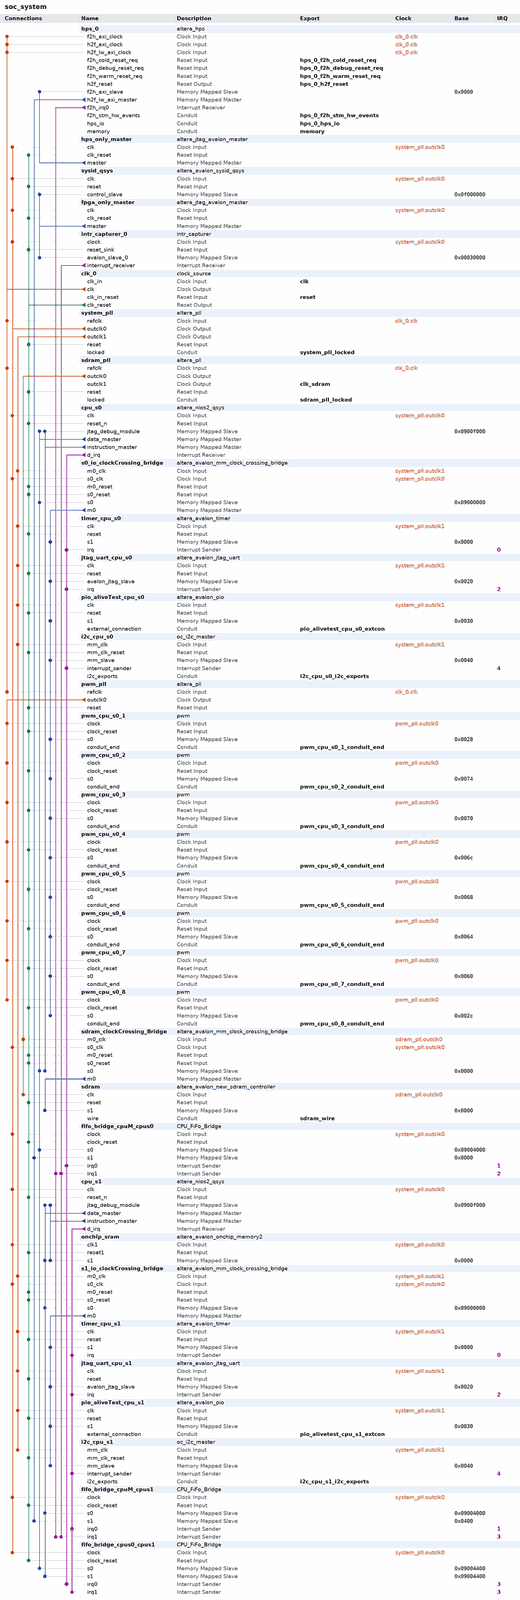
[diagram p0: system contents, whole]
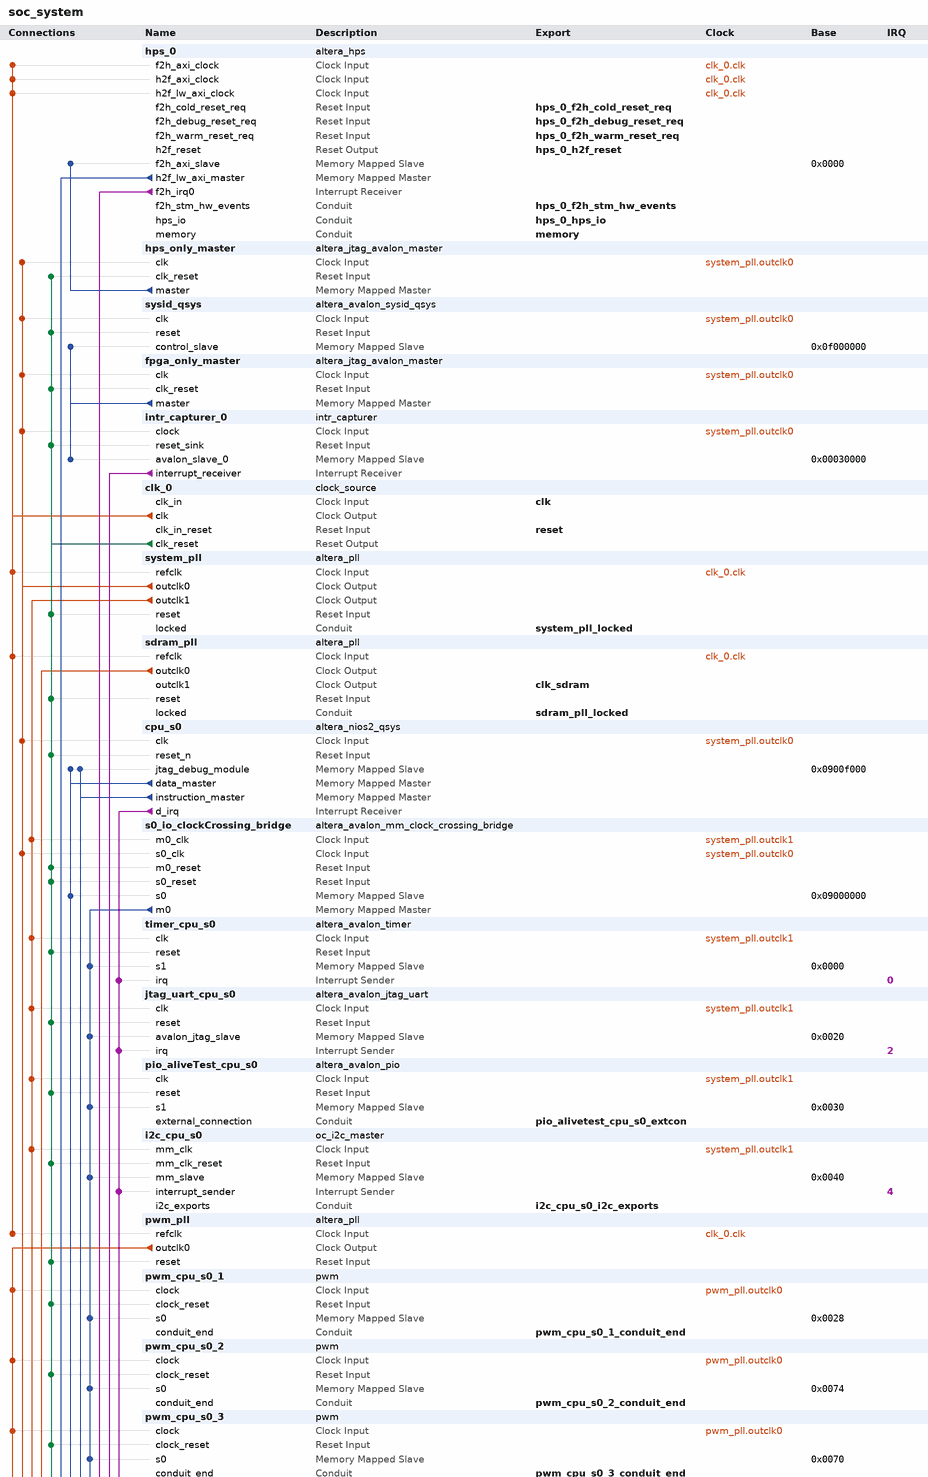
[diagram p1: system contents, upper part]
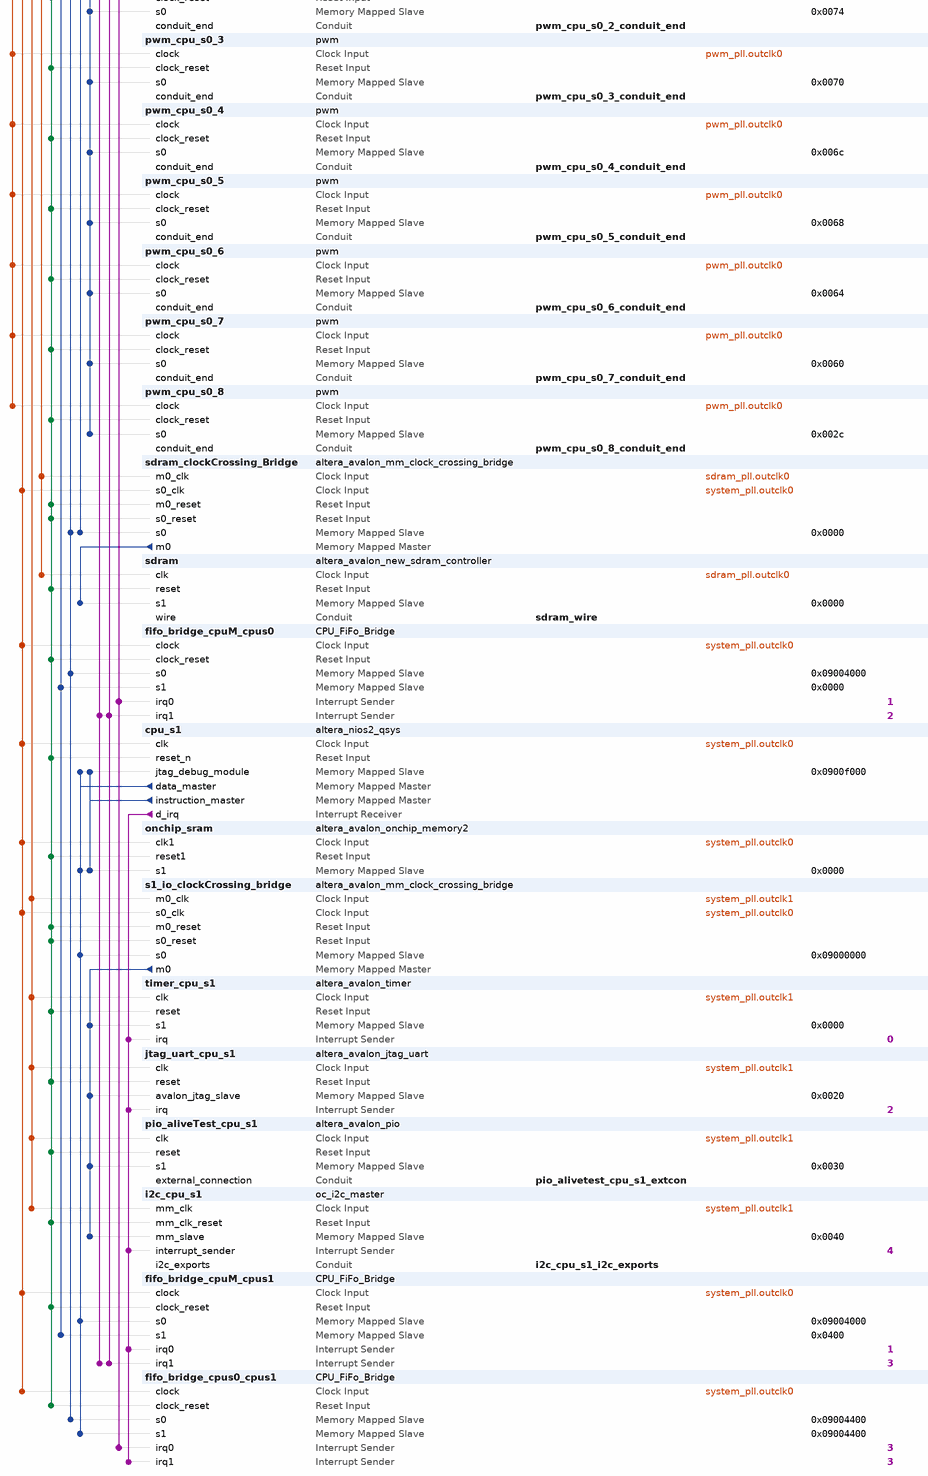
[diagram p2: system contents, lower part]
# Platform Designer (Qsys) system soc_system, Cyclone V 5CSEMA5F31C6
# Parameters at their usual value, and those the tool derives, are not listed.
package require -exact qsys 13.1
create_system soc_system
set_project_property DEVICE_FAMILY {Cyclone V}
set_project_property DEVICE 5CSEMA5F31C6

add_instance hps_0 altera_hps 13.1
set_instance_parameter_value hps_0 MEM_VENDOR JEDEC
set_instance_parameter_value hps_0 MEM_ROW_ADDR_WIDTH 15
set_instance_parameter_value hps_0 MEM_COL_ADDR_WIDTH 10
set_instance_parameter_value hps_0 MEM_DQ_WIDTH 32
set_instance_parameter_value hps_0 MEM_BANKADDR_WIDTH 3
set_instance_parameter_value hps_0 MEM_DRV_STR RZQ/7
set_instance_parameter_value hps_0 MEM_RTT_NOM RZQ/4
set_instance_parameter_value hps_0 MEM_RTT_WR RZQ/4
set_instance_parameter_value hps_0 MEM_WTCL 8
set_instance_parameter_value hps_0 MEM_TCL 11
set_instance_parameter_value hps_0 TIMING_TIS 180
set_instance_parameter_value hps_0 TIMING_TIH 140
set_instance_parameter_value hps_0 TIMING_TDS 30
set_instance_parameter_value hps_0 TIMING_TDH 65
set_instance_parameter_value hps_0 TIMING_TDQSQ 125
set_instance_parameter_value hps_0 TIMING_TDQSCK 255
set_instance_parameter_value hps_0 TIMING_TQSH 0.4
set_instance_parameter_value hps_0 MEM_TRAS_NS 35.0
set_instance_parameter_value hps_0 MEM_TRCD_NS 13.75
set_instance_parameter_value hps_0 MEM_TRP_NS 13.75
set_instance_parameter_value hps_0 MEM_TRFC_NS 260.0
set_instance_parameter_value hps_0 MEM_TFAW_NS 30.0
set_instance_parameter_value hps_0 REF_CLK_FREQ 25.0
set_instance_parameter_value hps_0 DEFAULT_FAST_SIM_MODEL true
set_instance_parameter_value hps_0 TIMING_BOARD_MAX_CK_DELAY 0.03
set_instance_parameter_value hps_0 TIMING_BOARD_MAX_DQS_DELAY 0.02
set_instance_parameter_value hps_0 TIMING_BOARD_SKEW_CKDQS_DIMM_MIN 0.09
set_instance_parameter_value hps_0 TIMING_BOARD_SKEW_CKDQS_DIMM_MAX 0.16
set_instance_parameter_value hps_0 TIMING_BOARD_SKEW_WITHIN_DQS 0.01
set_instance_parameter_value hps_0 TIMING_BOARD_SKEW_BETWEEN_DQS 0.08
set_instance_parameter_value hps_0 TIMING_BOARD_DQ_TO_DQS_SKEW 0.0
set_instance_parameter_value hps_0 TIMING_BOARD_AC_SKEW 0.03
set_instance_parameter_value hps_0 TIMING_BOARD_AC_TO_CK_SKEW 0.0
set_instance_parameter_value hps_0 MEM_CLK_FREQ 400.0
set_instance_parameter_value hps_0 HPS_PROTOCOL DDR3
set_instance_parameter_value hps_0 STM_Enable true
set_instance_parameter_value hps_0 F2S_Width 2
set_instance_parameter_value hps_0 S2F_Width 2
set_instance_parameter_value hps_0 LWH2F_Enable true
set_instance_parameter_value hps_0 F2SCLK_DBGRST_Enable true
set_instance_parameter_value hps_0 F2SCLK_WARMRST_Enable true
set_instance_parameter_value hps_0 F2SCLK_COLDRST_Enable true
set_instance_parameter_value hps_0 F2SINTERRUPT_Enable true
set_instance_parameter_value hps_0 EMAC1_PinMuxing {HPS I/O Set 0}
set_instance_parameter_value hps_0 EMAC1_Mode RGMII
set_instance_parameter_value hps_0 QSPI_PinMuxing {HPS I/O Set 0}
set_instance_parameter_value hps_0 QSPI_Mode {1 SS}
set_instance_parameter_value hps_0 SDIO_PinMuxing {HPS I/O Set 0}
set_instance_parameter_value hps_0 SDIO_Mode {4-bit Data}
set_instance_parameter_value hps_0 USB1_PinMuxing {HPS I/O Set 0}
set_instance_parameter_value hps_0 USB1_Mode SDR
set_instance_parameter_value hps_0 SPIM1_PinMuxing {HPS I/O Set 0}
set_instance_parameter_value hps_0 SPIM1_Mode {Single Slave Select}
set_instance_parameter_value hps_0 UART0_PinMuxing {HPS I/O Set 0}
set_instance_parameter_value hps_0 UART0_Mode {No Flow Control}
set_instance_parameter_value hps_0 I2C0_PinMuxing {HPS I/O Set 0}
set_instance_parameter_value hps_0 I2C0_Mode I2C
set_instance_parameter_value hps_0 I2C1_PinMuxing {HPS I/O Set 0}
set_instance_parameter_value hps_0 I2C1_Mode I2C
set_instance_parameter_value hps_0 S2FCLK_USER1CLK_FREQ 100
set_instance_parameter_value hps_0 FPGA_PERIPHERAL_OUTPUT_CLOCK_FREQ_EMAC0_MD_CLK 100
set_instance_parameter_value hps_0 FPGA_PERIPHERAL_OUTPUT_CLOCK_FREQ_EMAC0_GTX_CLK 100
set_instance_parameter_value hps_0 FPGA_PERIPHERAL_OUTPUT_CLOCK_FREQ_EMAC1_MD_CLK 100
set_instance_parameter_value hps_0 FPGA_PERIPHERAL_OUTPUT_CLOCK_FREQ_EMAC1_GTX_CLK 100

add_instance hps_only_master altera_jtag_avalon_master 13.1

add_instance sysid_qsys altera_avalon_sysid_qsys 13.1
set_instance_parameter_value sysid_qsys id -1395322110

add_instance fpga_only_master altera_jtag_avalon_master 13.1

add_instance intr_capturer_0 intr_capturer 100.99.98.97

add_instance clk_0 clock_source 13.1
set_instance_parameter_value clk_0 clockFrequency 50000000

add_instance system_pll altera_pll 13.1
set_instance_parameter_value system_pll gui_device_speed_grade 2
set_instance_parameter_value system_pll gui_pll_mode {Integer-N PLL}
set_instance_parameter_value system_pll gui_reference_clock_frequency 50.0
set_instance_parameter_value system_pll gui_operation_mode direct
set_instance_parameter_value system_pll gui_use_locked true
set_instance_parameter_value system_pll gui_number_of_clocks 2
set_instance_parameter_value system_pll gui_output_clock_frequency0 125.0
set_instance_parameter_value system_pll gui_output_clock_frequency1 25.0

add_instance sdram_pll altera_pll 13.1
set_instance_parameter_value sdram_pll gui_device_speed_grade 2
set_instance_parameter_value sdram_pll gui_pll_mode {Integer-N PLL}
set_instance_parameter_value sdram_pll gui_reference_clock_frequency 100.0
set_instance_parameter_value sdram_pll gui_operation_mode direct
set_instance_parameter_value sdram_pll gui_use_locked true
set_instance_parameter_value sdram_pll gui_number_of_clocks 2
set_instance_parameter_value sdram_pll gui_output_clock_frequency0 143.0
set_instance_parameter_value sdram_pll gui_output_clock_frequency1 143.0
set_instance_parameter_value sdram_pll gui_phase_shift1 -3758

add_instance cpu_s0 altera_nios2_qsys 13.1
set_instance_parameter_value cpu_s0 resetSlave sdram.s1
set_instance_parameter_value cpu_s0 mmu_TLBMissExcSlave None
set_instance_parameter_value cpu_s0 exceptionSlave sdram.s1
set_instance_parameter_value cpu_s0 breakSlave cpu_s0.jtag_debug_module
set_instance_parameter_value cpu_s0 impl Fast
set_instance_parameter_value cpu_s0 icache_size 4096
set_instance_parameter_value cpu_s0 icache_burstType Sequential
set_instance_parameter_value cpu_s0 dcache_size 0

add_instance s0_io_clockCrossing_bridge altera_avalon_mm_clock_crossing_bridge 13.1
set_instance_parameter_value s0_io_clockCrossing_bridge DATA_WIDTH 32
set_instance_parameter_value s0_io_clockCrossing_bridge ADDRESS_WIDTH 10
set_instance_parameter_value s0_io_clockCrossing_bridge MAX_BURST_SIZE 1
set_instance_parameter_value s0_io_clockCrossing_bridge COMMAND_FIFO_DEPTH 4
set_instance_parameter_value s0_io_clockCrossing_bridge RESPONSE_FIFO_DEPTH 4
set_instance_parameter_value s0_io_clockCrossing_bridge MASTER_SYNC_DEPTH 2
set_instance_parameter_value s0_io_clockCrossing_bridge SLAVE_SYNC_DEPTH 2

add_instance timer_cpu_s0 altera_avalon_timer 13.1
set_instance_parameter_value timer_cpu_s0 period 10
set_instance_parameter_value timer_cpu_s0 periodUnits MSEC

add_instance jtag_uart_cpu_s0 altera_avalon_jtag_uart 13.1
set_instance_parameter_value jtag_uart_cpu_s0 simInteractiveOptions NO_INTERACTIVE_WINDOWS

add_instance pio_aliveTest_cpu_s0 altera_avalon_pio 13.1
set_instance_parameter_value pio_aliveTest_cpu_s0 direction Output
set_instance_parameter_value pio_aliveTest_cpu_s0 width 2

add_instance i2c_cpu_s0 oc_i2c_master 8.0
set_instance_parameter_value i2c_cpu_s0 CLK_FREQ 25000000

add_instance pwm_pll altera_pll 13.1
set_instance_parameter_value pwm_pll gui_device_speed_grade 2
set_instance_parameter_value pwm_pll gui_pll_mode {Integer-N PLL}
set_instance_parameter_value pwm_pll gui_reference_clock_frequency 50.0
set_instance_parameter_value pwm_pll gui_operation_mode direct
set_instance_parameter_value pwm_pll gui_use_locked true
set_instance_parameter_value pwm_pll gui_number_of_clocks 1
set_instance_parameter_value pwm_pll gui_output_clock_frequency0 1.505199
set_instance_parameter_value pwm_pll gui_actual_output_clock_frequency0 {1.505050 MHz}

add_instance pwm_cpu_s0_1 pwm 1.0

add_instance pwm_cpu_s0_2 pwm 1.0

add_instance pwm_cpu_s0_3 pwm 1.0

add_instance pwm_cpu_s0_4 pwm 1.0

add_instance pwm_cpu_s0_5 pwm 1.0

add_instance pwm_cpu_s0_6 pwm 1.0

add_instance pwm_cpu_s0_7 pwm 1.0

add_instance pwm_cpu_s0_8 pwm 1.0

add_instance sdram_clockCrossing_Bridge altera_avalon_mm_clock_crossing_bridge 13.1
set_instance_parameter_value sdram_clockCrossing_Bridge DATA_WIDTH 32
set_instance_parameter_value sdram_clockCrossing_Bridge ADDRESS_WIDTH 26
set_instance_parameter_value sdram_clockCrossing_Bridge MAX_BURST_SIZE 8
set_instance_parameter_value sdram_clockCrossing_Bridge COMMAND_FIFO_DEPTH 4
set_instance_parameter_value sdram_clockCrossing_Bridge RESPONSE_FIFO_DEPTH 16
set_instance_parameter_value sdram_clockCrossing_Bridge MASTER_SYNC_DEPTH 2
set_instance_parameter_value sdram_clockCrossing_Bridge SLAVE_SYNC_DEPTH 2

add_instance sdram altera_avalon_new_sdram_controller 13.1
set_instance_parameter_value sdram TAC 5.4
set_instance_parameter_value sdram TRCD 15.0
set_instance_parameter_value sdram TRP 15.0
set_instance_parameter_value sdram casLatency 3
set_instance_parameter_value sdram columnWidth 10
set_instance_parameter_value sdram dataWidth 16
set_instance_parameter_value sdram generateSimulationModel false
set_instance_parameter_value sdram model single_Micron_MT48LC4M32B2_7_chip
set_instance_parameter_value sdram numberOfBanks 4
set_instance_parameter_value sdram numberOfChipSelects 1
set_instance_parameter_value sdram powerUpDelay 100.0
set_instance_parameter_value sdram refreshPeriod 7.8125
set_instance_parameter_value sdram rowWidth 13

add_instance fifo_bridge_cpuM_cpus0 CPU_FiFo_Bridge 1.0

add_instance cpu_s1 altera_nios2_qsys 13.1
set_instance_parameter_value cpu_s1 resetSlave onchip_sram.s1
set_instance_parameter_value cpu_s1 mmu_TLBMissExcSlave None
set_instance_parameter_value cpu_s1 exceptionSlave onchip_sram.s1
set_instance_parameter_value cpu_s1 breakSlave cpu_s1.jtag_debug_module
set_instance_parameter_value cpu_s1 impl Fast
set_instance_parameter_value cpu_s1 icache_size 4096
set_instance_parameter_value cpu_s1 dcache_size 0

add_instance onchip_sram altera_avalon_onchip_memory2 13.1
set_instance_parameter_value onchip_sram dataWidth 32
set_instance_parameter_value onchip_sram dualPort false
set_instance_parameter_value onchip_sram initMemContent true
set_instance_parameter_value onchip_sram initializationFileName onchip_memory2_0
set_instance_parameter_value onchip_sram memorySize 360448

add_instance s1_io_clockCrossing_bridge altera_avalon_mm_clock_crossing_bridge 13.1
set_instance_parameter_value s1_io_clockCrossing_bridge DATA_WIDTH 32
set_instance_parameter_value s1_io_clockCrossing_bridge ADDRESS_WIDTH 10
set_instance_parameter_value s1_io_clockCrossing_bridge MAX_BURST_SIZE 1
set_instance_parameter_value s1_io_clockCrossing_bridge COMMAND_FIFO_DEPTH 4
set_instance_parameter_value s1_io_clockCrossing_bridge RESPONSE_FIFO_DEPTH 4
set_instance_parameter_value s1_io_clockCrossing_bridge MASTER_SYNC_DEPTH 2
set_instance_parameter_value s1_io_clockCrossing_bridge SLAVE_SYNC_DEPTH 2

add_instance timer_cpu_s1 altera_avalon_timer 13.1
set_instance_parameter_value timer_cpu_s1 period 10
set_instance_parameter_value timer_cpu_s1 periodUnits MSEC

add_instance jtag_uart_cpu_s1 altera_avalon_jtag_uart 13.1
set_instance_parameter_value jtag_uart_cpu_s1 simInteractiveOptions NO_INTERACTIVE_WINDOWS

add_instance pio_aliveTest_cpu_s1 altera_avalon_pio 13.1
set_instance_parameter_value pio_aliveTest_cpu_s1 direction Output
set_instance_parameter_value pio_aliveTest_cpu_s1 width 2

add_instance i2c_cpu_s1 oc_i2c_master 8.0
set_instance_parameter_value i2c_cpu_s1 CLK_FREQ 25000000

add_instance fifo_bridge_cpuM_cpus1 CPU_FiFo_Bridge 1.0

add_instance fifo_bridge_cpus0_cpus1 CPU_FiFo_Bridge 1.0

# connections
add_connection clk_0.clk hps_0.f2h_axi_clock clock
add_connection clk_0.clk hps_0.h2f_axi_clock clock
add_connection clk_0.clk hps_0.h2f_lw_axi_clock clock
add_connection clk_0.clk pwm_pll.refclk clock
add_connection clk_0.clk sdram_pll.refclk clock
add_connection clk_0.clk system_pll.refclk clock
add_connection pwm_pll.outclk0 pwm_cpu_s0_1.clock clock
add_connection pwm_pll.outclk0 pwm_cpu_s0_2.clock clock
add_connection pwm_pll.outclk0 pwm_cpu_s0_3.clock clock
add_connection pwm_pll.outclk0 pwm_cpu_s0_4.clock clock
add_connection pwm_pll.outclk0 pwm_cpu_s0_5.clock clock
add_connection pwm_pll.outclk0 pwm_cpu_s0_6.clock clock
add_connection pwm_pll.outclk0 pwm_cpu_s0_7.clock clock
add_connection pwm_pll.outclk0 pwm_cpu_s0_8.clock clock
add_connection sdram_pll.outclk0 sdram.clk clock
add_connection sdram_pll.outclk0 sdram_clockCrossing_Bridge.m0_clk clock
add_connection system_pll.outclk0 cpu_s0.clk clock
add_connection system_pll.outclk0 cpu_s1.clk clock
add_connection system_pll.outclk0 fifo_bridge_cpuM_cpus0.clock clock
add_connection system_pll.outclk0 fifo_bridge_cpuM_cpus1.clock clock
add_connection system_pll.outclk0 fifo_bridge_cpus0_cpus1.clock clock
add_connection system_pll.outclk0 fpga_only_master.clk clock
add_connection system_pll.outclk0 hps_only_master.clk clock
add_connection system_pll.outclk0 intr_capturer_0.clock clock
add_connection system_pll.outclk0 onchip_sram.clk1 clock
add_connection system_pll.outclk0 s0_io_clockCrossing_bridge.s0_clk clock
add_connection system_pll.outclk0 s1_io_clockCrossing_bridge.s0_clk clock
add_connection system_pll.outclk0 sdram_clockCrossing_Bridge.s0_clk clock
add_connection system_pll.outclk0 sysid_qsys.clk clock
add_connection system_pll.outclk1 i2c_cpu_s0.mm_clk clock
add_connection system_pll.outclk1 i2c_cpu_s1.mm_clk clock
add_connection system_pll.outclk1 jtag_uart_cpu_s0.clk clock
add_connection system_pll.outclk1 jtag_uart_cpu_s1.clk clock
add_connection system_pll.outclk1 pio_aliveTest_cpu_s0.clk clock
add_connection system_pll.outclk1 pio_aliveTest_cpu_s1.clk clock
add_connection system_pll.outclk1 s0_io_clockCrossing_bridge.m0_clk clock
add_connection system_pll.outclk1 s1_io_clockCrossing_bridge.m0_clk clock
add_connection system_pll.outclk1 timer_cpu_s0.clk clock
add_connection system_pll.outclk1 timer_cpu_s1.clk clock
add_connection clk_0.clk_reset cpu_s0.reset_n reset
add_connection clk_0.clk_reset cpu_s1.reset_n reset
add_connection clk_0.clk_reset fifo_bridge_cpuM_cpus0.clock_reset reset
add_connection clk_0.clk_reset fifo_bridge_cpuM_cpus1.clock_reset reset
add_connection clk_0.clk_reset fifo_bridge_cpus0_cpus1.clock_reset reset
add_connection clk_0.clk_reset fpga_only_master.clk_reset reset
add_connection clk_0.clk_reset hps_only_master.clk_reset reset
add_connection clk_0.clk_reset i2c_cpu_s0.mm_clk_reset reset
add_connection clk_0.clk_reset i2c_cpu_s1.mm_clk_reset reset
add_connection clk_0.clk_reset intr_capturer_0.reset_sink reset
add_connection clk_0.clk_reset jtag_uart_cpu_s0.reset reset
add_connection clk_0.clk_reset jtag_uart_cpu_s1.reset reset
add_connection clk_0.clk_reset onchip_sram.reset1 reset
add_connection clk_0.clk_reset pio_aliveTest_cpu_s0.reset reset
add_connection clk_0.clk_reset pio_aliveTest_cpu_s1.reset reset
add_connection clk_0.clk_reset pwm_cpu_s0_1.clock_reset reset
add_connection clk_0.clk_reset pwm_cpu_s0_2.clock_reset reset
add_connection clk_0.clk_reset pwm_cpu_s0_3.clock_reset reset
add_connection clk_0.clk_reset pwm_cpu_s0_4.clock_reset reset
add_connection clk_0.clk_reset pwm_cpu_s0_5.clock_reset reset
add_connection clk_0.clk_reset pwm_cpu_s0_6.clock_reset reset
add_connection clk_0.clk_reset pwm_cpu_s0_7.clock_reset reset
add_connection clk_0.clk_reset pwm_cpu_s0_8.clock_reset reset
add_connection clk_0.clk_reset pwm_pll.reset reset
add_connection clk_0.clk_reset s0_io_clockCrossing_bridge.m0_reset reset
add_connection clk_0.clk_reset s0_io_clockCrossing_bridge.s0_reset reset
add_connection clk_0.clk_reset s1_io_clockCrossing_bridge.m0_reset reset
add_connection clk_0.clk_reset s1_io_clockCrossing_bridge.s0_reset reset
add_connection clk_0.clk_reset sdram.reset reset
add_connection clk_0.clk_reset sdram_clockCrossing_Bridge.m0_reset reset
add_connection clk_0.clk_reset sdram_clockCrossing_Bridge.s0_reset reset
add_connection clk_0.clk_reset sdram_pll.reset reset
add_connection clk_0.clk_reset sysid_qsys.reset reset
add_connection clk_0.clk_reset system_pll.reset reset
add_connection clk_0.clk_reset timer_cpu_s0.reset reset
add_connection clk_0.clk_reset timer_cpu_s1.reset reset
add_connection cpu_s0.data_master cpu_s0.jtag_debug_module avalon
set_connection_parameter_value cpu_s0.data_master/cpu_s0.jtag_debug_module baseAddress 0x0900f000
add_connection cpu_s0.data_master fifo_bridge_cpuM_cpus0.s0 avalon
set_connection_parameter_value cpu_s0.data_master/fifo_bridge_cpuM_cpus0.s0 baseAddress 0x09004000
add_connection cpu_s0.data_master fifo_bridge_cpus0_cpus1.s0 avalon
set_connection_parameter_value cpu_s0.data_master/fifo_bridge_cpus0_cpus1.s0 baseAddress 0x09004400
add_connection cpu_s0.data_master s0_io_clockCrossing_bridge.s0 avalon
set_connection_parameter_value cpu_s0.data_master/s0_io_clockCrossing_bridge.s0 baseAddress 0x09000000
add_connection cpu_s0.data_master sdram_clockCrossing_Bridge.s0 avalon
set_connection_parameter_value cpu_s0.data_master/sdram_clockCrossing_Bridge.s0 baseAddress 0x0000
add_connection cpu_s0.instruction_master cpu_s0.jtag_debug_module avalon
set_connection_parameter_value cpu_s0.instruction_master/cpu_s0.jtag_debug_module baseAddress 0x0900f000
add_connection cpu_s0.instruction_master sdram_clockCrossing_Bridge.s0 avalon
set_connection_parameter_value cpu_s0.instruction_master/sdram_clockCrossing_Bridge.s0 baseAddress 0x0000
add_connection cpu_s1.data_master cpu_s1.jtag_debug_module avalon
set_connection_parameter_value cpu_s1.data_master/cpu_s1.jtag_debug_module baseAddress 0x0900f000
add_connection cpu_s1.data_master fifo_bridge_cpuM_cpus1.s0 avalon
set_connection_parameter_value cpu_s1.data_master/fifo_bridge_cpuM_cpus1.s0 baseAddress 0x09004000
add_connection cpu_s1.data_master fifo_bridge_cpus0_cpus1.s1 avalon
set_connection_parameter_value cpu_s1.data_master/fifo_bridge_cpus0_cpus1.s1 baseAddress 0x09004400
add_connection cpu_s1.data_master onchip_sram.s1 avalon
set_connection_parameter_value cpu_s1.data_master/onchip_sram.s1 baseAddress 0x0000
add_connection cpu_s1.data_master s1_io_clockCrossing_bridge.s0 avalon
set_connection_parameter_value cpu_s1.data_master/s1_io_clockCrossing_bridge.s0 baseAddress 0x09000000
add_connection cpu_s1.instruction_master cpu_s1.jtag_debug_module avalon
set_connection_parameter_value cpu_s1.instruction_master/cpu_s1.jtag_debug_module baseAddress 0x0900f000
add_connection cpu_s1.instruction_master onchip_sram.s1 avalon
set_connection_parameter_value cpu_s1.instruction_master/onchip_sram.s1 baseAddress 0x0000
add_connection fpga_only_master.master intr_capturer_0.avalon_slave_0 avalon
set_connection_parameter_value fpga_only_master.master/intr_capturer_0.avalon_slave_0 baseAddress 0x00030000
add_connection fpga_only_master.master sysid_qsys.control_slave avalon
set_connection_parameter_value fpga_only_master.master/sysid_qsys.control_slave baseAddress 0x0f000000
add_connection hps_0.h2f_lw_axi_master fifo_bridge_cpuM_cpus0.s1 avalon
set_connection_parameter_value hps_0.h2f_lw_axi_master/fifo_bridge_cpuM_cpus0.s1 baseAddress 0x0000
add_connection hps_0.h2f_lw_axi_master fifo_bridge_cpuM_cpus1.s1 avalon
set_connection_parameter_value hps_0.h2f_lw_axi_master/fifo_bridge_cpuM_cpus1.s1 baseAddress 0x0400
add_connection hps_only_master.master hps_0.f2h_axi_slave avalon
set_connection_parameter_value hps_only_master.master/hps_0.f2h_axi_slave baseAddress 0x0000
add_connection s0_io_clockCrossing_bridge.m0 i2c_cpu_s0.mm_slave avalon
set_connection_parameter_value s0_io_clockCrossing_bridge.m0/i2c_cpu_s0.mm_slave baseAddress 0x0040
add_connection s0_io_clockCrossing_bridge.m0 jtag_uart_cpu_s0.avalon_jtag_slave avalon
set_connection_parameter_value s0_io_clockCrossing_bridge.m0/jtag_uart_cpu_s0.avalon_jtag_slave baseAddress 0x0020
add_connection s0_io_clockCrossing_bridge.m0 pio_aliveTest_cpu_s0.s1 avalon
set_connection_parameter_value s0_io_clockCrossing_bridge.m0/pio_aliveTest_cpu_s0.s1 baseAddress 0x0030
add_connection s0_io_clockCrossing_bridge.m0 pwm_cpu_s0_1.s0 avalon
set_connection_parameter_value s0_io_clockCrossing_bridge.m0/pwm_cpu_s0_1.s0 baseAddress 0x0028
add_connection s0_io_clockCrossing_bridge.m0 pwm_cpu_s0_2.s0 avalon
set_connection_parameter_value s0_io_clockCrossing_bridge.m0/pwm_cpu_s0_2.s0 baseAddress 0x0074
add_connection s0_io_clockCrossing_bridge.m0 pwm_cpu_s0_3.s0 avalon
set_connection_parameter_value s0_io_clockCrossing_bridge.m0/pwm_cpu_s0_3.s0 baseAddress 0x0070
add_connection s0_io_clockCrossing_bridge.m0 pwm_cpu_s0_4.s0 avalon
set_connection_parameter_value s0_io_clockCrossing_bridge.m0/pwm_cpu_s0_4.s0 baseAddress 0x006c
add_connection s0_io_clockCrossing_bridge.m0 pwm_cpu_s0_5.s0 avalon
set_connection_parameter_value s0_io_clockCrossing_bridge.m0/pwm_cpu_s0_5.s0 baseAddress 0x0068
add_connection s0_io_clockCrossing_bridge.m0 pwm_cpu_s0_6.s0 avalon
set_connection_parameter_value s0_io_clockCrossing_bridge.m0/pwm_cpu_s0_6.s0 baseAddress 0x0064
add_connection s0_io_clockCrossing_bridge.m0 pwm_cpu_s0_7.s0 avalon
set_connection_parameter_value s0_io_clockCrossing_bridge.m0/pwm_cpu_s0_7.s0 baseAddress 0x0060
add_connection s0_io_clockCrossing_bridge.m0 pwm_cpu_s0_8.s0 avalon
set_connection_parameter_value s0_io_clockCrossing_bridge.m0/pwm_cpu_s0_8.s0 baseAddress 0x002c
add_connection s0_io_clockCrossing_bridge.m0 timer_cpu_s0.s1 avalon
set_connection_parameter_value s0_io_clockCrossing_bridge.m0/timer_cpu_s0.s1 baseAddress 0x0000
add_connection s1_io_clockCrossing_bridge.m0 i2c_cpu_s1.mm_slave avalon
set_connection_parameter_value s1_io_clockCrossing_bridge.m0/i2c_cpu_s1.mm_slave baseAddress 0x0040
add_connection s1_io_clockCrossing_bridge.m0 jtag_uart_cpu_s1.avalon_jtag_slave avalon
set_connection_parameter_value s1_io_clockCrossing_bridge.m0/jtag_uart_cpu_s1.avalon_jtag_slave baseAddress 0x0020
add_connection s1_io_clockCrossing_bridge.m0 pio_aliveTest_cpu_s1.s1 avalon
set_connection_parameter_value s1_io_clockCrossing_bridge.m0/pio_aliveTest_cpu_s1.s1 baseAddress 0x0030
add_connection s1_io_clockCrossing_bridge.m0 timer_cpu_s1.s1 avalon
set_connection_parameter_value s1_io_clockCrossing_bridge.m0/timer_cpu_s1.s1 baseAddress 0x0000
add_connection sdram_clockCrossing_Bridge.m0 sdram.s1 avalon
set_connection_parameter_value sdram_clockCrossing_Bridge.m0/sdram.s1 baseAddress 0x0000
add_connection cpu_s0.d_irq fifo_bridge_cpuM_cpus0.irq0 interrupt
set_connection_parameter_value cpu_s0.d_irq/fifo_bridge_cpuM_cpus0.irq0 irqNumber 1
add_connection cpu_s0.d_irq fifo_bridge_cpus0_cpus1.irq0 interrupt
set_connection_parameter_value cpu_s0.d_irq/fifo_bridge_cpus0_cpus1.irq0 irqNumber 3
add_connection cpu_s0.d_irq i2c_cpu_s0.interrupt_sender interrupt
set_connection_parameter_value cpu_s0.d_irq/i2c_cpu_s0.interrupt_sender irqNumber 4
add_connection cpu_s0.d_irq jtag_uart_cpu_s0.irq interrupt
set_connection_parameter_value cpu_s0.d_irq/jtag_uart_cpu_s0.irq irqNumber 2
add_connection cpu_s0.d_irq timer_cpu_s0.irq interrupt
set_connection_parameter_value cpu_s0.d_irq/timer_cpu_s0.irq irqNumber 0
add_connection cpu_s1.d_irq fifo_bridge_cpuM_cpus1.irq0 interrupt
set_connection_parameter_value cpu_s1.d_irq/fifo_bridge_cpuM_cpus1.irq0 irqNumber 1
add_connection cpu_s1.d_irq fifo_bridge_cpus0_cpus1.irq1 interrupt
set_connection_parameter_value cpu_s1.d_irq/fifo_bridge_cpus0_cpus1.irq1 irqNumber 3
add_connection cpu_s1.d_irq i2c_cpu_s1.interrupt_sender interrupt
set_connection_parameter_value cpu_s1.d_irq/i2c_cpu_s1.interrupt_sender irqNumber 4
add_connection cpu_s1.d_irq jtag_uart_cpu_s1.irq interrupt
set_connection_parameter_value cpu_s1.d_irq/jtag_uart_cpu_s1.irq irqNumber 2
add_connection cpu_s1.d_irq timer_cpu_s1.irq interrupt
set_connection_parameter_value cpu_s1.d_irq/timer_cpu_s1.irq irqNumber 0
add_connection hps_0.f2h_irq0 fifo_bridge_cpuM_cpus0.irq1 interrupt
set_connection_parameter_value hps_0.f2h_irq0/fifo_bridge_cpuM_cpus0.irq1 irqNumber 2
add_connection hps_0.f2h_irq0 fifo_bridge_cpuM_cpus1.irq1 interrupt
set_connection_parameter_value hps_0.f2h_irq0/fifo_bridge_cpuM_cpus1.irq1 irqNumber 3
add_connection intr_capturer_0.interrupt_receiver fifo_bridge_cpuM_cpus0.irq1 interrupt
set_connection_parameter_value intr_capturer_0.interrupt_receiver/fifo_bridge_cpuM_cpus0.irq1 irqNumber 2
add_connection intr_capturer_0.interrupt_receiver fifo_bridge_cpuM_cpus1.irq1 interrupt
set_connection_parameter_value intr_capturer_0.interrupt_receiver/fifo_bridge_cpuM_cpus1.irq1 irqNumber 3

# exported interfaces
add_interface clk clock sink
set_interface_property clk EXPORT_OF clk_0.clk_in
add_interface reset reset sink
set_interface_property reset EXPORT_OF clk_0.clk_in_reset
add_interface memory conduit end
set_interface_property memory EXPORT_OF hps_0.memory
add_interface hps_0_hps_io conduit end
set_interface_property hps_0_hps_io EXPORT_OF hps_0.hps_io
add_interface hps_0_h2f_reset reset source
set_interface_property hps_0_h2f_reset EXPORT_OF hps_0.h2f_reset
add_interface hps_0_f2h_stm_hw_events conduit end
set_interface_property hps_0_f2h_stm_hw_events EXPORT_OF hps_0.f2h_stm_hw_events
add_interface hps_0_f2h_warm_reset_req reset sink
set_interface_property hps_0_f2h_warm_reset_req EXPORT_OF hps_0.f2h_warm_reset_req
add_interface hps_0_f2h_debug_reset_req reset sink
set_interface_property hps_0_f2h_debug_reset_req EXPORT_OF hps_0.f2h_debug_reset_req
add_interface hps_0_f2h_cold_reset_req reset sink
set_interface_property hps_0_f2h_cold_reset_req EXPORT_OF hps_0.f2h_cold_reset_req
add_interface pio_alivetest_cpu_s0_extcon conduit end
set_interface_property pio_alivetest_cpu_s0_extcon EXPORT_OF pio_aliveTest_cpu_s0.external_connection
add_interface sdram_wire conduit end
set_interface_property sdram_wire EXPORT_OF sdram.wire
add_interface pio_alivetest_cpu_s1_extcon conduit end
set_interface_property pio_alivetest_cpu_s1_extcon EXPORT_OF pio_aliveTest_cpu_s1.external_connection
add_interface system_pll_locked conduit end
set_interface_property system_pll_locked EXPORT_OF system_pll.locked
add_interface sdram_pll_locked conduit end
set_interface_property sdram_pll_locked EXPORT_OF sdram_pll.locked
add_interface i2c_cpu_s0_i2c_exports conduit end
set_interface_property i2c_cpu_s0_i2c_exports EXPORT_OF i2c_cpu_s0.i2c_exports
add_interface i2c_cpu_s1_i2c_exports conduit end
set_interface_property i2c_cpu_s1_i2c_exports EXPORT_OF i2c_cpu_s1.i2c_exports
add_interface pwm_cpu_s0_1_conduit_end conduit end
set_interface_property pwm_cpu_s0_1_conduit_end EXPORT_OF pwm_cpu_s0_1.conduit_end
add_interface clk_sdram clock source
set_interface_property clk_sdram EXPORT_OF sdram_pll.outclk1
add_interface pwm_cpu_s0_2_conduit_end conduit end
set_interface_property pwm_cpu_s0_2_conduit_end EXPORT_OF pwm_cpu_s0_2.conduit_end
add_interface pwm_cpu_s0_3_conduit_end conduit end
set_interface_property pwm_cpu_s0_3_conduit_end EXPORT_OF pwm_cpu_s0_3.conduit_end
add_interface pwm_cpu_s0_4_conduit_end conduit end
set_interface_property pwm_cpu_s0_4_conduit_end EXPORT_OF pwm_cpu_s0_4.conduit_end
add_interface pwm_cpu_s0_5_conduit_end conduit end
set_interface_property pwm_cpu_s0_5_conduit_end EXPORT_OF pwm_cpu_s0_5.conduit_end
add_interface pwm_cpu_s0_6_conduit_end conduit end
set_interface_property pwm_cpu_s0_6_conduit_end EXPORT_OF pwm_cpu_s0_6.conduit_end
add_interface pwm_cpu_s0_7_conduit_end conduit end
set_interface_property pwm_cpu_s0_7_conduit_end EXPORT_OF pwm_cpu_s0_7.conduit_end
add_interface pwm_cpu_s0_8_conduit_end conduit end
set_interface_property pwm_cpu_s0_8_conduit_end EXPORT_OF pwm_cpu_s0_8.conduit_end

set_interconnect_requirement {$system} qsys_mm.clockCrossingAdapter HANDSHAKE
set_interconnect_requirement {$system} qsys_mm.maxAdditionalLatency 1

save_system soc_system.qsys
